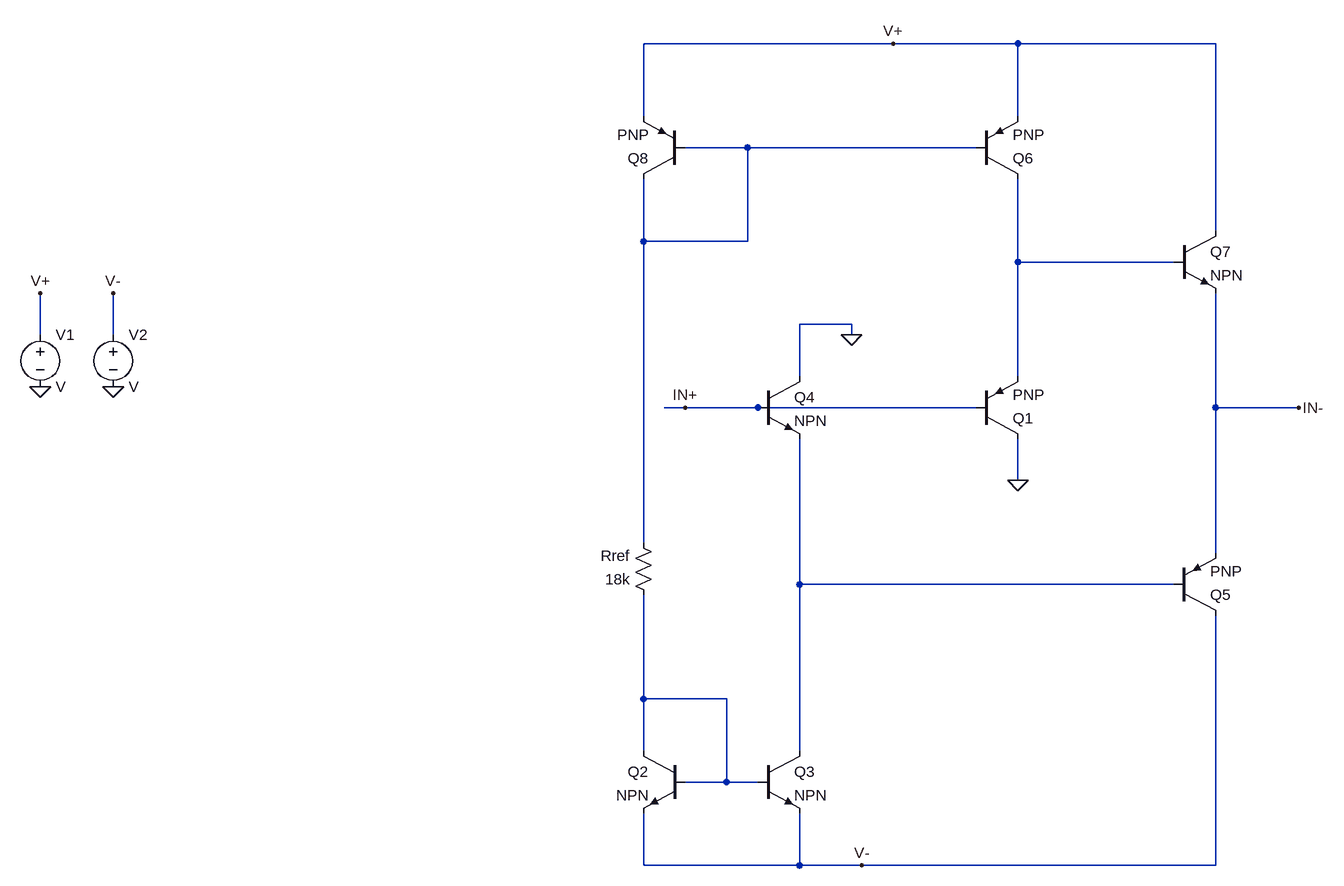
[diagram p0: schematic EtapaEntradav1.asc]
EtapaEntradav1.asc, the LTspice schematic file:
Version 4
SHEET 1 1828 1100
WIRE 576 -928 192 -928
WIRE 768 -928 576 -928
WIRE 1072 -928 768 -928
WIRE 192 -816 192 -928
WIRE 768 -816 768 -928
WIRE 352 -768 256 -768
WIRE 704 -768 352 -768
WIRE 1072 -640 1072 -928
WIRE 192 -624 192 -720
WIRE 352 -624 352 -768
WIRE 352 -624 192 -624
WIRE 768 -592 768 -720
WIRE 1008 -592 768 -592
WIRE 512 -496 432 -496
WIRE -736 -480 -736 -544
WIRE -624 -480 -624 -544
WIRE 512 -480 512 -496
WIRE 432 -416 432 -496
WIRE 768 -416 768 -592
WIRE 256 -368 224 -368
WIRE 368 -368 256 -368
WIRE 704 -368 368 -368
WIRE 1072 -368 1072 -544
WIRE 1200 -368 1072 -368
WIRE 768 -256 768 -320
WIRE 192 -160 192 -624
WIRE 1072 -144 1072 -368
WIRE 432 -96 432 -320
WIRE 1008 -96 432 -96
WIRE 192 80 192 -80
WIRE 320 80 192 80
WIRE 192 160 192 80
WIRE 432 160 432 -96
WIRE 320 208 320 80
WIRE 320 208 256 208
WIRE 368 208 320 208
WIRE 192 336 192 256
WIRE 432 336 432 256
WIRE 432 336 192 336
WIRE 528 336 432 336
WIRE 1072 336 1072 -48
WIRE 1072 336 528 336
FLAG 768 -256 0
FLAG 512 -480 0
FLAG 256 -368 IN+
FLAG 1200 -368 IN-
FLAG -736 -400 0
FLAG -624 -400 0
FLAG -736 -544 V+
FLAG 576 -928 V+
FLAG -624 -544 V-
FLAG 528 336 V-
SYMBOL pnp 704 -320 M180
SYMATTR InstName Q1
SYMBOL npn 256 160 M0
SYMATTR InstName Q2
SYMBOL npn 368 160 R0
SYMATTR InstName Q3
SYMBOL npn 368 -416 R0
SYMATTR InstName Q4
SYMBOL npn 1008 -640 R0
SYMATTR InstName Q7
SYMBOL pnp 704 -720 M180
SYMATTR InstName Q6
SYMBOL pnp 256 -720 R180
SYMATTR InstName Q8
SYMBOL pnp 1008 -48 M180
SYMATTR InstName Q5
SYMBOL res 208 -64 R180
WINDOW 0 36 76 Left 2
WINDOW 3 36 40 Left 2
SYMATTR InstName Rref
SYMATTR Value 18k
SYMBOL voltage -736 -496 R0
SYMATTR InstName V1
SYMBOL voltage -624 -496 R0
SYMATTR InstName V2

The netlist it stands for:
* EtapaEntradav1.asc
Q1 0 IN+ N002 0 PNP
Q2 N004 N004 V- 0 NPN
Q3 N003 N004 V- 0 NPN
Q4 0 IN+ N003 0 NPN
Q7 V+ N002 IN- 0 NPN
Q6 N002 N001 V+ 0 PNP
Q8 N001 N001 V+ 0 PNP
Q5 V- N003 IN- 0 PNP
Rref N004 N001 18k
V1 V+ 0 V
V2 V- 0 V
.model NPN NPN
.model PNP PNP
.lib standard.bjt
.backanno
.end